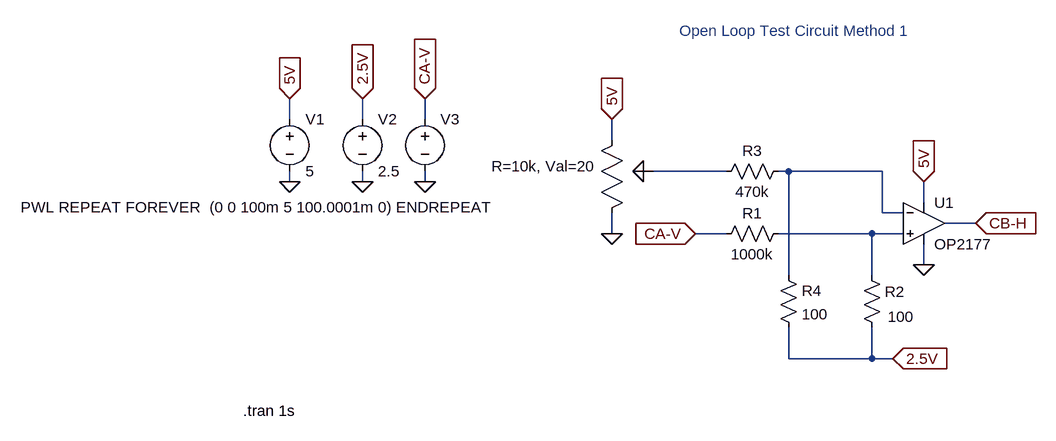
[diagram p0: schematic open_loop_gain_test_ckt_ltspice.asc]
open_loop_gain_test_ckt_ltspice.asc, the LTspice schematic file:
Version 4
SHEET 1 880 680
WIRE -768 16 -768 -16
WIRE -656 16 -656 -16
WIRE -560 16 -560 -16
WIRE -272 48 -272 16
WIRE -96 96 -208 96
WIRE 0 96 -16 96
WIRE 144 96 0 96
WIRE -768 112 -768 96
WIRE -656 112 -656 96
WIRE -560 112 -560 96
WIRE 208 144 208 112
WIRE 144 160 144 96
WIRE 176 160 144 160
WIRE 288 176 240 176
WIRE -272 192 -272 160
WIRE -96 192 -144 192
WIRE 128 192 -16 192
WIRE 176 192 128 192
WIRE 208 240 208 208
WIRE 0 256 0 96
WIRE 128 256 128 192
WIRE 0 384 0 336
WIRE 128 384 128 336
WIRE 128 384 0 384
WIRE 160 384 128 384
FLAG 208 240 0
FLAG 208 112 5V
IOPIN 208 112 In
FLAG 288 176 CB-H
IOPIN 288 176 In
FLAG 160 384 2.5V
IOPIN 160 384 In
FLAG -144 192 CA-V
IOPIN -144 192 In
FLAG -272 192 0
FLAG -272 16 5V
IOPIN -272 16 In
FLAG -768 112 0
FLAG -656 112 0
FLAG -560 112 0
FLAG -768 -16 5V
IOPIN -768 -16 In
FLAG -656 -16 2.5V
IOPIN -656 -16 In
FLAG -560 -16 CA-V
IOPIN -560 -16 In
SYMBOL res 0 176 R90
WINDOW 0 0 56 VBottom 2
WINDOW 3 32 56 VTop 2
SYMATTR InstName R1
SYMATTR Value 1000k
SYMBOL res 144 352 R180
WINDOW 0 -35 71 Left 2
WINDOW 3 -49 32 Left 2
SYMATTR InstName R2
SYMATTR Value 100
SYMBOL res -112 112 R270
WINDOW 0 32 56 VTop 2
WINDOW 3 0 56 VBottom 2
SYMATTR InstName R3
SYMATTR Value 470k
SYMBOL res -16 240 R0
SYMATTR InstName R4
SYMATTR Value 100
SYMBOL potentiometer -256 64 M0
WINDOW 0 26 -31 Invisible 0
WINDOW 39 42 24 Left 2
SYMATTR InstName X1
SYMATTR SpiceLine R=10k, Val=20
SYMBOL voltage -768 0 R0
WINDOW 123 0 0 Left 0
WINDOW 39 0 0 Left 0
SYMATTR InstName V1
SYMATTR Value 5
SYMBOL voltage -656 0 R0
WINDOW 123 0 0 Left 0
WINDOW 39 0 0 Left 0
SYMATTR InstName V2
SYMATTR Value 2.5
SYMBOL voltage -560 0 R0
WINDOW 3 -622 151 Left 2
SYMATTR InstName V3
SYMATTR Value PWL REPEAT FOREVER  (0 0 100m 5 100.0001m 0) ENDREPEAT
SYMBOL Opamps\\OP2177 208 112 R0
SYMATTR InstName U1
TEXT -168 -120 Left 2 ;Open Loop Test Circuit Method 1
TEXT -840 464 Left 2 !.tran 1s

The netlist it stands for:
* open_loop_gain_test_ckt_ltspice.asc
R1 N003 CA-V 1000k
R2 2.5V N003 100
R3 N001 N002 470k
R4 N002 2.5V 100
XX1 5V N001 0 potentiometer R=10k, Val=20  ; pins 1 2 3
V1 5V 0 5
V2 2.5V 0 2.5
V3 CA-V 0 PWL REPEAT FOREVER  (0 0 100m 5 100.0001m 0) ENDREPEAT
XU1 N003 N002 5V 0 CB-H OP2177  ; pins In+ In- V+ V- OUT
* Open Loop Test Circuit Method 1
.tran 1s
.backanno
.end